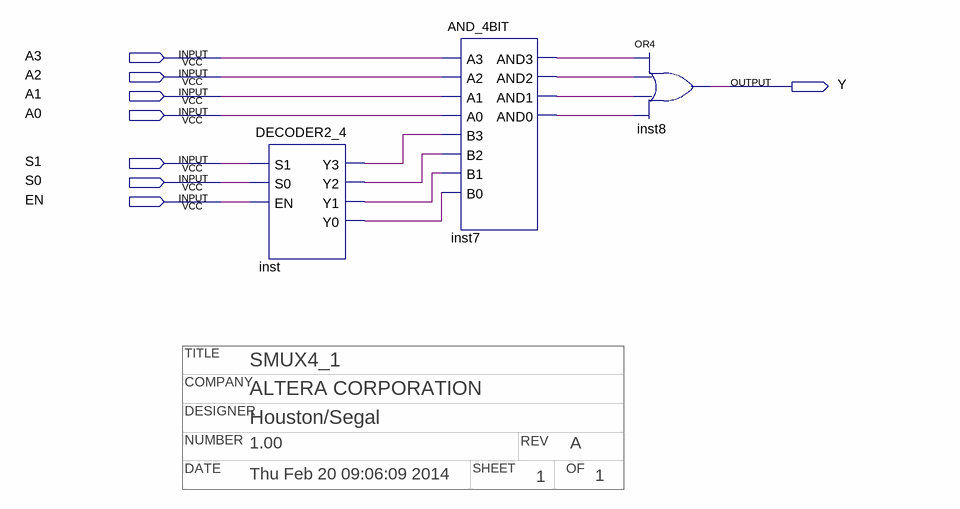
[diagram p0: schematic sheet]
// Quartus schematic SMUX4_1.bdf as structural Verilog: 3 symbols, 8 pins
// Title block: TITLE: SMUX4_1; COMPANY: ALTERA CORPORATION; DESIGNER: Houston/Segal; NUMBER: 1.00; REV: A; DATE: Thu Feb 20 09:06:09 2014; SHEET: 1; OF: 1
module SMUX4_1 (
  input  A3,
  input  A2,
  input  A1,
  input  A0,
  input  S1,
  input  S0,
  input  EN,
  output Y
);

  wire inst7_and0, inst7_and1, inst7_and2, inst7_and3, inst_y0, inst_y1, inst_y2, inst_y3;

  DECODER2_4 inst (.S1(S1), .S0(S0), .EN(EN), .Y3(inst_y3), .Y2(inst_y2), .Y1(inst_y1), .Y0(inst_y0));
  AND_4BIT inst7 (
    .A3(A3), .A2(A2), .A1(A1), .A0(A0), .B3(inst_y3), .B2(inst_y2), .B1(inst_y1), .B0(inst_y0),
    .AND3(inst7_and3), .AND2(inst7_and2), .AND1(inst7_and1), .AND0(inst7_and0));
  or inst8 (Y, inst7_and3, inst7_and2, inst7_and1, inst7_and0);
endmodule
